# EAGLE design pwm_driver (EAGLE 7.5.0)
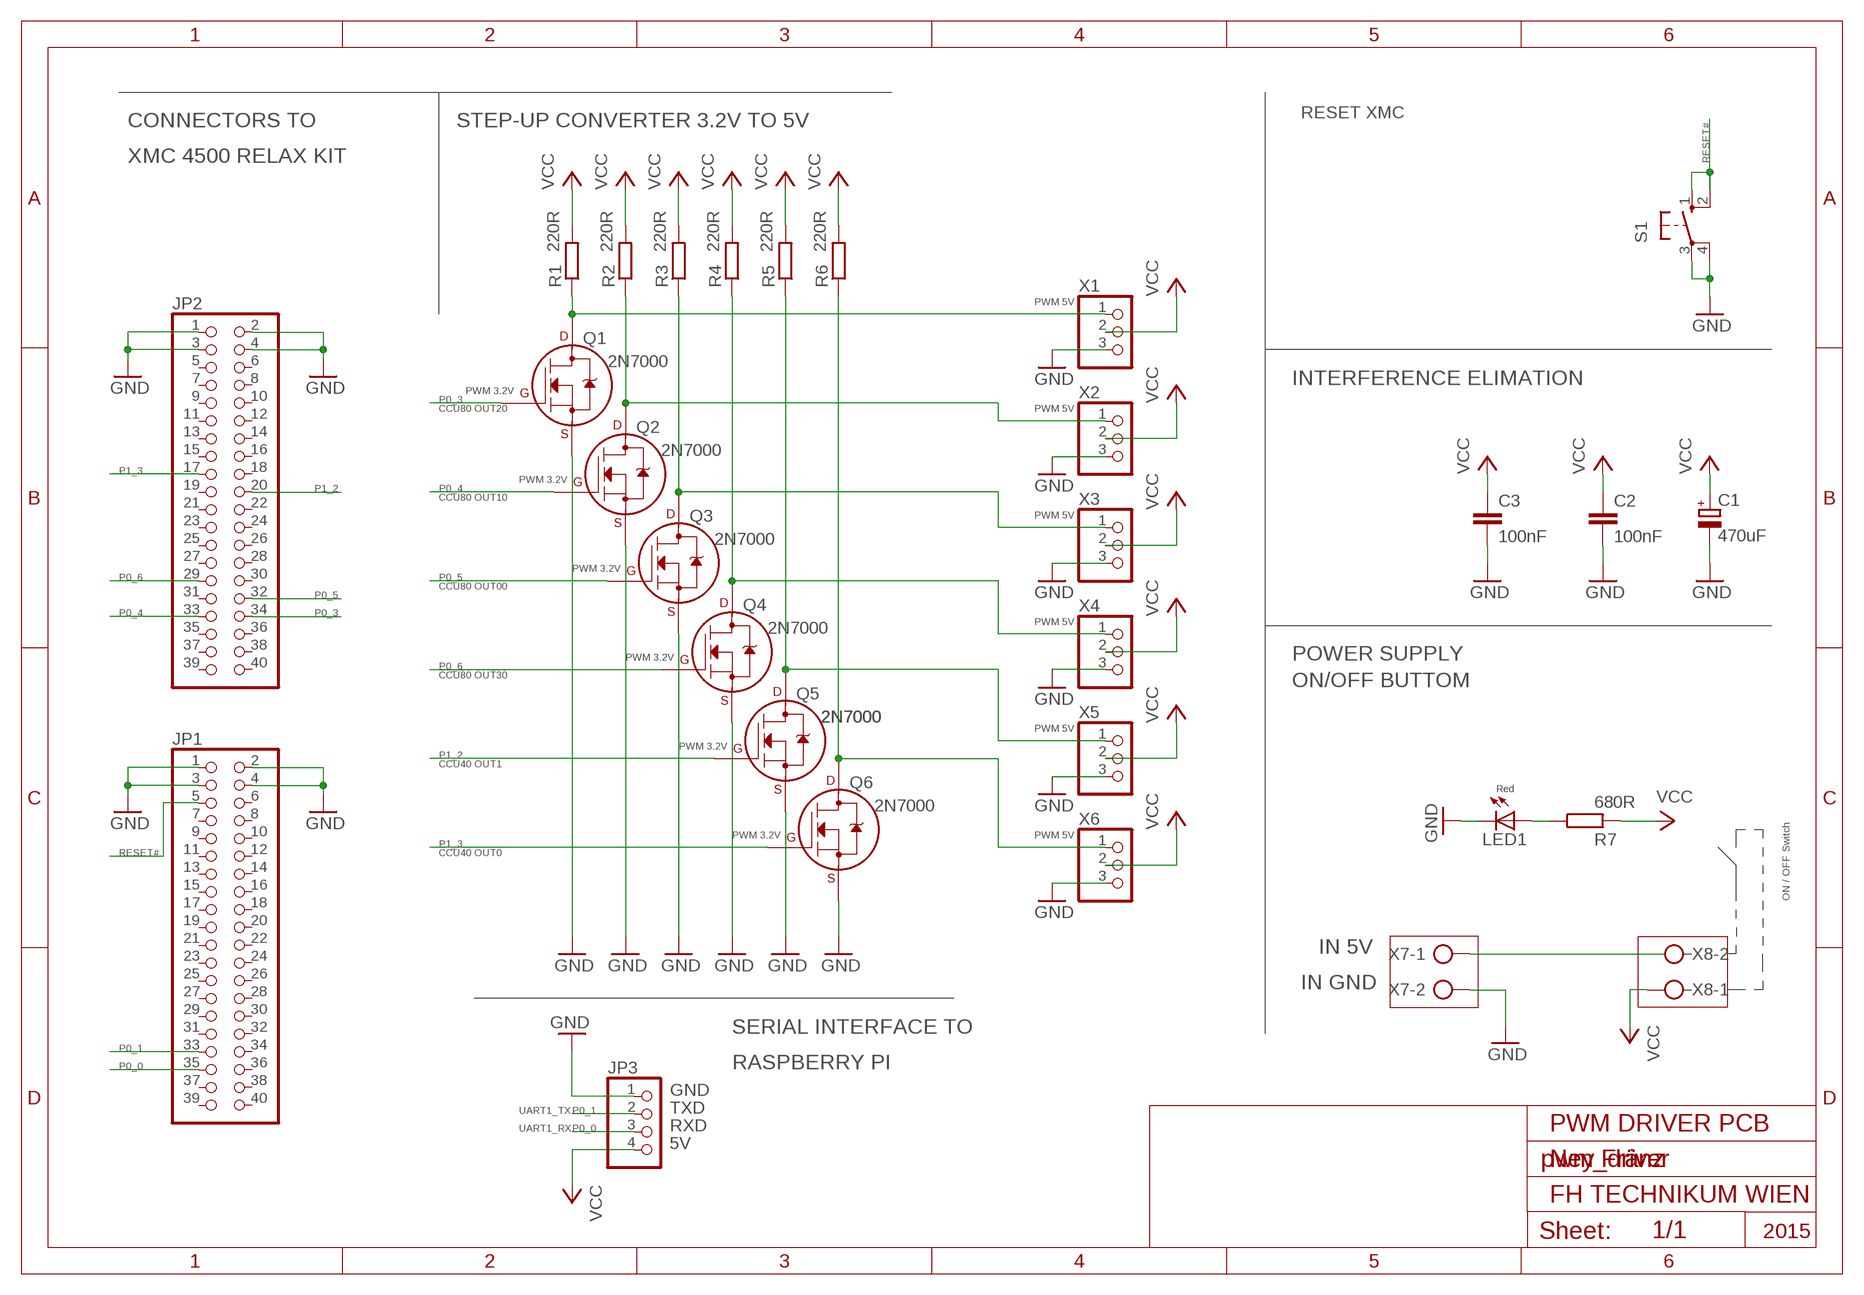
[diagram p0: schematic, sheet 1]

## Parts
C1  470uF  CPOL-EUE3.5-10  [E3,5-10]
C2  100nF  C-EU025-024X044  [C025-024X044]
C3  100nF  C-EU025-024X044  [C025-024X044]
JP1  PINHD-2X20  [2X20]
JP2  PINHD-2X20  [2X20]
JP3  PINHD-1X4  [1X04]
LED1  LED3MM  [LED3MM]
Q1  2N7000_TO92  [TO-92]
Q2  2N7000_TO92  [TO-92]
Q3  2N7000_TO92  [TO-92]
Q4  2N7000_TO92  [TO-92]
Q5  2N7000_TO92  [TO-92]
Q6  2N7000_TO92  [TO-92]
R1  220R  R-EU_0207/10  [0207/10]
R2  220R  R-EU_0207/10  [0207/10]
R3  220R  R-EU_0207/10  [0207/10]
R4  220R  R-EU_0207/10  [0207/10]
R5  220R  R-EU_0207/10  [0207/10]
R6  220R  R-EU_0207/10  [0207/10]
R7  680R  R-EU_0207/10  [0207/10]
S1  10-XX  [B3F-10XX]
X1  PINHD-1X3  [1X03]
X2  PINHD-1X3  [1X03]
X3  PINHD-1X3  [1X03]
X4  PINHD-1X3  [1X03]
X5  PINHD-1X3  [1X03]
X6  PINHD-1X3  [1X03]
X7  AK500/2  [AK500/2]
X8  AK500/2  [AK500/2]

## Nets
GND: C1.- C2.2 C3.2 JP1.1 JP1.2 JP1.3 JP1.4 JP2.1 JP2.2 JP2.3 JP2.4 JP3.1 LED1.K(C) Q1.1(S) Q2.1(S) Q3.1(S) Q4.1(S) Q5.1(S) Q6.1(S) S1.3(P) S1.4(P1) X1.3 X2.3 X3.3 X4.3 X5.3 X6.3 X7.2
N$1: LED1.A R7.1
N$2: X7.1 X8.2
N$4: Q1.3(D) R1.1 X1.1
N$5: Q2.3(D) R2.1 X2.1
N$6: Q3.3(D) R3.1 X3.1
N$7: Q4.3(D) R4.1 X4.1
N$11: Q5.3(D) R5.1 X5.1
N$17: Q6.3(D) R6.1 X6.1
P0_0: JP1.35 JP3.3
P0_1: JP1.33 JP3.2
P0_3: JP2.34 Q1.2(G)
P0_4: JP2.33 Q2.2(G)
P0_5: JP2.32 Q3.2(G)
P0_6: JP2.29 Q4.2(G)
P1_2: JP2.20 Q5.2(G)
P1_3: JP2.17 Q6.2(G)
RESET: JP1.5 S1.1(S) S1.2(S1)
VCC: C1.+ C2.1 C3.1 JP3.4 R1.2 R2.2 R3.2 R4.2 R5.2 R6.2 R7.2 X1.2 X2.2 X3.2 X4.2 X5.2 X6.2 X8.1
Unconnected: JP1.6 JP1.7 JP1.8 JP1.9 JP1.10 JP1.11 JP1.12 JP1.13 JP1.14 JP1.15 JP1.16 JP1.17 JP1.18 JP1.19 JP1.20 JP1.21 JP1.22 JP1.23 JP1.24 JP1.25 JP1.26 JP1.27 JP1.28 JP1.29 JP1.30 JP1.31 JP1.32 JP1.34 JP1.36 JP1.37 JP1.38 JP1.39 JP1.40 JP2.5 JP2.6 JP2.7 JP2.8 JP2.9 JP2.10 JP2.11 JP2.12 JP2.13 JP2.14 JP2.15 JP2.16 JP2.18 JP2.19 JP2.21 JP2.22 JP2.23 JP2.24 JP2.25 JP2.26 JP2.27 JP2.28 JP2.30 JP2.31 JP2.35 JP2.36 JP2.37 JP2.38 JP2.39 JP2.40

## Notes on the sheet
- RESET XMC
- CONNECTORS TO | STEP-UP CONVERTER 3.2V TO 5V
- XMC 4500 RELAX KIT | RESET#
- PWM 5V
- 2N7000
- INTERFERENCE ELIMATION
- PWM 3.2V
- P0_3
- CCU80 OUT20 | PWM 5V
- 2N7000
- P1_3
- PWM 3.2V
- P1_2 | P0_4
- CCU80 OUT10
- PWM 5V
- 2N7000
- PWM 3.2V
- P0_6 | P0_5
- CCU80 OUT00
- P0_5
- P0_4 | P0_3
- PWM 5V
- 2N7000
- PWM 3.2V | POWER SUPPLY
- P0_6
- CCU80 OUT30
- ON/OFF BUTTOM
- 2N7000 | 2N7000
- PWM 5V
- PWM 3.2V
- P1_2
- CCU40 OUT1
- Red
- 2N7000
- PWM 3.2V | PWM 5V
- P1_3
- RESET# | CCU40 OUT0
- ON / OFF Switch
- IN 5V
- IN GND
- SERIAL INTERFACE TO
- P0_1
- P0_0 | RASPBERRY PI
- GND
- UART1_TX | P0_1 | TXD
- UART1_RX | P0_0 | RXD | PWM DRIVER PCB
- 5V
- Ney Fränz
- FH TECHNIKUM WIEN
- 2015

## Library data of the parts
C1 = rcl:CPOL-EU: POLARIZED CAPACITOR, European symbol
C2 C3 = rcl:C-EU: CAPACITOR, European symbol
JP1 JP2 = pinhead:PINHD-2X20: PIN HEADER
JP3 = pinhead:PINHD-1X4: PIN HEADER
LED1 = led:LED: LED OSRAM: - CHIPLED LG R971, LG N971, LY N971, LG Q971, LY Q971, LO R971, LY R971 LH N974, LH R974 LS Q976, LO Q976, LY Q976 LO Q996 - Hyper CHIPLED LW Q18S LB Q993, LB Q99A, LB R99A - SideLED LS A670, LO A670, LY A670, LG A670, LP A670 LB A673, LV A673, LT A673, LW A673 LH A674 LY A675 LS A676, LA A676, LO A676, LY A676, LW A676 LS A679, LY A679, LG A679 - Hyper Micro SIDELED® LS Y876, LA Y876, LO Y876, LY Y876 LT Y87S - SmartLED LW L88C, LW L88S LB L89C, LB L89S, LG L890 LS L89K, LO L89K, LY L89K LS L896, LA L896, LO L896, LY L896 - TOPLED LS T670, LO T670, LY T670, LG T670, LP T670 LSG T670, LSP T670, LSY T670, LOP T670, LYG T670 LG T671, LOG T671, LSG T671 LB T673, LV T673, LT T673, LW T673 LH T674 LS T676, LA T676, LO T676, LY T676, LB T676, LH T676, LSB T676, LW T676 LB T67C, LV T67C, LT T67C, LS T67K, LO T67K, LY T67K, LW E67C LS E67B, LA E67B, LO E67B, LY E67B, LB E67C, LV E67C, LT E67C LW T67C LS T679, LY T679, LG T679 LS T770, LO T770, LY T770, LG T770, LP T770 LB T773, LV T773, LT T773, LW T773 LH T774 LS E675, LA E675, LY E675, LS T675 LS T776, LA T776, LO T776, LY T776, LB T776 LHGB T686 LT T68C, LB T68C - Hyper Mini TOPLED® LB M676 - Mini TOPLED Santana® LG M470 LS M47K, LO M47K, LY M47K Source: http://www.osram.convergy.de LUXEON: - LUMILED® LXK2-PW12-R00, LXK2-PW12-S00, LXK2-PW14-U00, LXK2-PW14-V00 LXK2-PM12-R00, LXK2-PM12-S00, LXK2-PM14-U00 LXK2-PE12-Q00, LXK2-PE12-R00, LXK2-PE12-S00, LXK2-PE14-T00, LXK2-PE14-U00 LXK2-PB12-K00, LXK2-PB12-L00, LXK2-PB12-M00, LXK2-PB14-N00, LXK2-PB14-P00, LXK2-PB14-Q00 LXK2-PR12-L00, LXK2-PR12-M00, LXK2-PR14-Q00, LXK2-PR14-R00 LXK2-PD12-Q00, LXK2-PD12-R00, LXK2-PD12-S00 LXK2-PH12-R00, LXK2-PH12-S00 LXK2-PL12-P00, LXK2-PL12-Q00, LXK2-PL12-R00 Source: www.luxeon.com KINGBRIGHT: KA-3528ASYC Source: www.kingbright.com
Q1-Q6 = transistors:2N700*: 2N7000, 2N7002, NDS7002A N-channel enhancement mode MOSFET
R1-R7 = resistor:R-EU_: RESISTOR, European symbol
S1 = switch-omron:10-XX: OMRON SWITCH; MPN: B3F-1000; OC_FARNELL: 176432; OC_NEWARK: 36M3542
X1-X6 = pinhead:PINHD-1X3: PIN HEADER
X7 X8 = con-ptr500:AK500/2: CONNECTOR; OC_FARNELL: unknown; OC_NEWARK: unknown

## Board
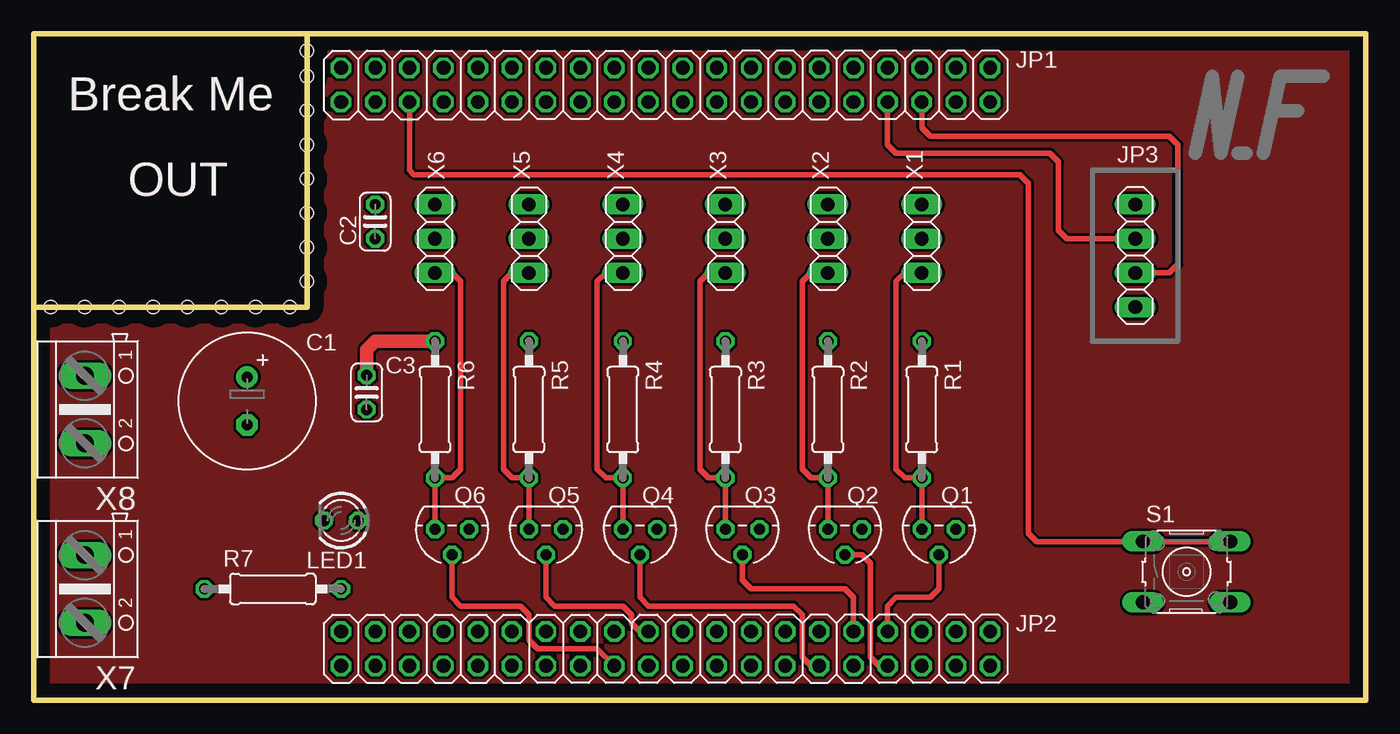
[diagram p1: board, top side]
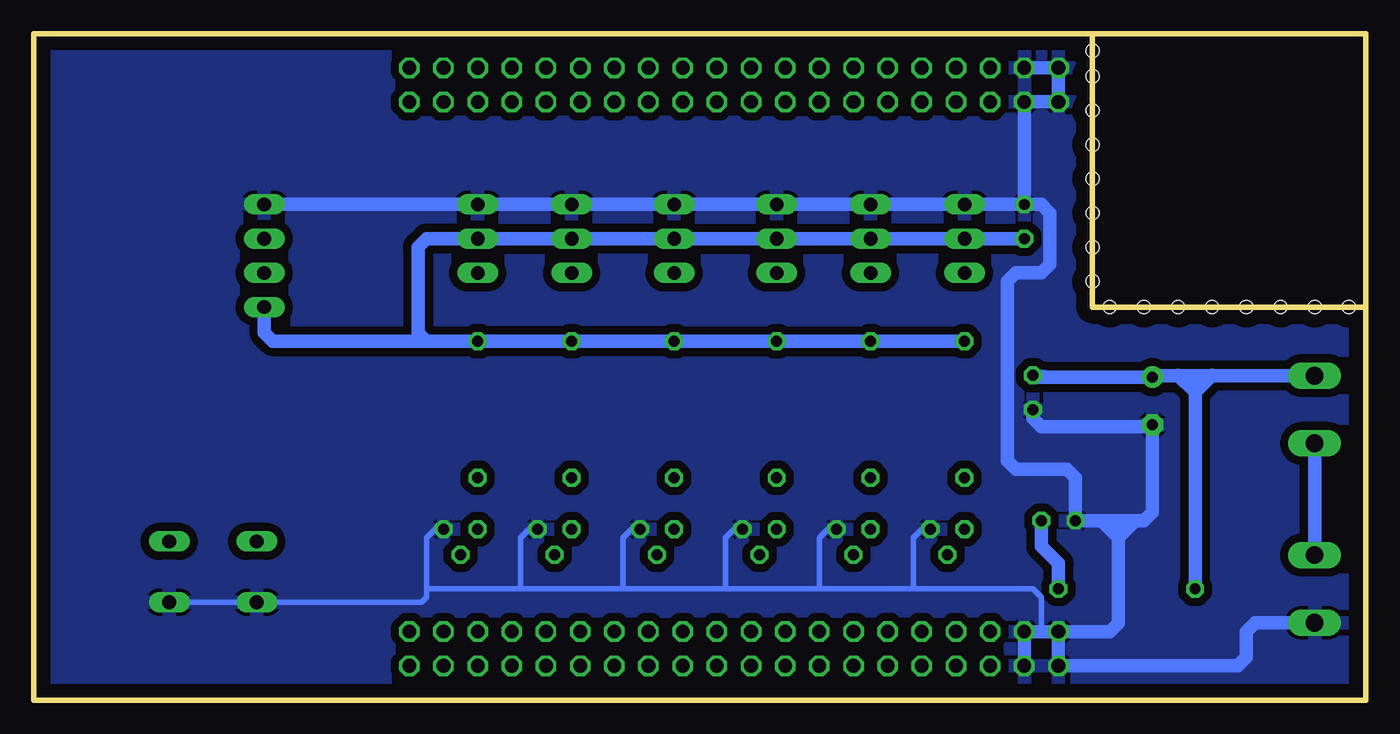
[diagram p2: board, bottom side, seen from below]

Size 99.06 x 49.53 mm. Coordinates in mm from the lower left corner, seen from the top.
Outline: 0,29.21 0,0 99.06,0 99.06,49.53 20.32,49.53
Outline: 0,29.21 0,49.53 20.32,49.53
Outline: 20.32,49.53 20.32,29.21 0,29.21
Copper layers (1*16): Top 0.035mm / dielectric 1.5mm / Bottom 0.035mm
Design rules "default": minimum track width 10mil, minimum drill 24mil, track to track 8mil, track to pad 8mil, pad to pad 8mil, via to via 8mil, smd to smd 8mil, copper to edge 40mil, drill to drill 8mil, minimum pad ring 10mil, minimum via ring 8mil, stop-mask expansion 4mil, vias tented up to drill 0mil, thermal gap 10mil
Holes 1 mm at 1.27,29.21 3.81,29.21 6.35,29.21 8.89,29.21 11.43,29.21 13.97,29.21 16.51,29.21 19.05,29.21 20.32,31.11 20.32,33.66 20.32,36.2 20.32,38.73 20.32,41.27 20.32,43.81 20.32,46.35 20.32,48.26

### Footprints (pad centres in the part's own frame; a part is rotated, then mirrored left to right if it is on the bottom)
E3,5-10 = drill 0.813 pad 1.6: + -1.778,0 | drill 0.813 pad 1.6 octagon: - 1.778,0
C025-024X044 = drill 0.813 octagon: 1 -1.27,0; 2 1.27,0
2X20 = drill 1.016 octagon: 1 -24.13,-1.27; 2 -24.13,1.27; 3 -21.59,-1.27; 4 -21.59,1.27; 5 -19.05,-1.27; 6 -19.05,1.27; 7 -16.51,-1.27; 8 -16.51,1.27; 9 -13.97,-1.27; 10 -13.97,1.27; 11 -11.43,-1.27; 12 -11.43,1.27; 13 -8.89,-1.27; 14 -8.89,1.27; 15 -6.35,-1.27; 16 -6.35,1.27; 17 -3.81,-1.27; 18 -3.81,1.27; 19 -1.27,-1.27; 20 -1.27,1.27; 21 1.27,-1.27; 22 1.27,1.27; 23 3.81,-1.27; 24 3.81,1.27; 25 6.35,-1.27; 26 6.35,1.27; 27 8.89,-1.27; 28 8.89,1.27; 29 11.43,-1.27; 30 11.43,1.27; 31 13.97,-1.27; 32 13.97,1.27; 33 16.51,-1.27; 34 16.51,1.27; 35 19.05,-1.27; 36 19.05,1.27; 37 21.59,-1.27; 38 21.59,1.27; 39 24.13,-1.27; 40 24.13,1.27
1X04 = drill 1.016 long: 1 -3.81,0; 2 -1.27,0; 3 1.27,0; 4 3.81,0
LED3MM = drill 0.813 octagon: A -1.27,0; K 1.27,0
TO-92 = drill 0.813 octagon: 1 -1.27,0; 2 0,1.905; 3 1.27,0
0207/10 = drill 0.813 octagon: 1 -5.08,0; 2 5.08,0
B3F-10XX = drill 1.016 long: 1 -3.251,2.261; 2 3.251,2.261; 3 -3.251,-2.261; 4 3.251,-2.261
1X03 = drill 1.016 long: 1 -2.54,0; 2 0,0; 3 2.54,0
AK500/2 = drill 1.321 long: 1 -2.515,0; 2 2.515,0

### Placement (x,y rotation side)
C1  15.88,22.23 270 top
C2  25.4,35.56 90 top
C3  24.77,22.86 270 top
JP1  46.99,45.72 0 top
JP2  46.99,3.81 0 top
JP3  81.92,33.02 270 top
LED1  22.86,13.34 180 top
Q1  67.31,12.7 180 top
Q2  60.33,12.7 180 top
Q3  52.7,12.7 180 top
Q4  45.09,12.7 180 top
Q5  38.1,12.7 180 top
Q6  31.11,12.7 180 top
R1  66.04,21.59 90 top
R2  59.05,21.59 90 top
R3  51.44,21.59 90 top
R4  43.81,21.59 90 top
R5  36.83,21.59 90 top
R6  29.84,21.59 90 top
R7  17.78,8.26 180 top
S1  85.72,9.53 0 top
X1  66.04,34.29 90 top
X2  59.05,34.29 90 top
X3  51.44,34.29 90 top
X4  43.81,34.29 90 top
X5  36.83,34.29 90 top
X6  29.84,34.29 90 top
X7  3.81,8.26 270 top
X8  3.81,21.59 270 top

### Tracks (layer width: path | path; a pad name or v marks a point on that pad's centre or on a via)
GND
  Bottom 0.406: Q6.1 33.02,12.7 33.66,12.06 33.66,8.26 | 33.66,8.26 24.77,8.26 24.13,7.62 24.13,5.08 | Q5.1 40.01,12.7 40.64,12.06 40.64,8.26 | 40.64,8.26 33.66,8.26 | Q4.1 46.99,12.7 47.62,12.06 47.62,8.26 | 47.62,8.26 40.64,8.26 | Q3.1 54.61,12.7 55.24,12.06 55.24,8.26 | 55.24,8.26 47.62,8.26 | Q2.1 62.23,12.7 62.87,12.06 62.87,8.26 | 62.87,8.26 55.24,8.26 | Q1.1 69.22,12.7 69.85,12.06 69.85,8.26 | 69.85,8.26 62.87,8.26 | S1.3 S1.4 70.21,7.26 69.85,7.62 69.85,8.26
  Bottom 1.016: JP2.2 24.13,5.08 JP2.4 JP2.3 | JP2.2 JP2.1 9.53,2.54 8.89,3.17 8.89,5.08 8.23,5.74 X7.2 | JP1.4 JP1.2 JP1.1 JP1.3 C2.2 | JP3.1 X1.3 X2.3 X3.3 X4.3 X5.3 X6.3 C2.2 | C2.2 24.13,36.83 23.5,36.2 23.5,32.38 24.13,31.75 26.04,31.75 26.67,31.11 26.67,17.78 26.04,17.14 22.23,17.14 21.59,16.51 LED1.K 19.68,13.34 | 18.41,13.34 17.14,13.34 | 17.14,13.34 16.51,13.34 15.88,13.97 C1.- 16,20.32 24.13,20.32 24.77,20.95 C3.2 | 19.68,13.34 18.41,13.34 | 18.41,13.34 18.41,12.06 | 18.41,12.06 18.41,5.71 19.05,5.08 JP2.2 | 18.41,12.06 17.14,13.34 | 18.41,12.06 19.68,13.34
  pour Bottom (isolate 0.61): 0,49.53 99.06,49.53 99.06,0 0,0
N$1
  Bottom 1.016: R7.1 22.86,10.16 24.13,11.43 LED1.A
N$2
  Bottom 1.016: X7.1 X8.2
N$3
  pour Top: 0,0 0,28.57 20.32,28.57 20.32,29.21 20.32,48.9 20.32,49.53 99.06,49.53 99.06,0
N$4
  Top 0.406: Q1.3 R1.1 64.77,16.51 64.14,17.14 64.14,31.11 64.77,31.75 X1.1
N$5
  Top 0.406: Q2.3 R2.1 57.78,16.51 57.15,17.14 57.15,31.11 57.78,31.75 X2.1
N$6
  Top 0.406: Q3.3 R3.1 50.16,16.51 49.53,17.14 49.53,31.11 50.16,31.75 X3.1
N$7
  Top 0.406: Q4.3 R4.1 42.55,16.51 41.91,17.14 41.91,31.11 42.55,31.75 X4.1
N$11
  Top 0.406: Q5.3 R5.1 35.56,16.51 34.92,17.14 34.92,31.11 35.56,31.75 X5.1
N$17
  Top 0.406: Q6.3 R6.1 31.11,16.51 31.75,17.14 31.75,31.11 31.11,31.75 X6.1
P0_0
  Top 0.406: JP3.3 84.45,31.75 85.09,32.38 85.09,41.27 84.45,41.91 66.67,41.91 66.04,42.55 JP1.35
P0_1
  Top 0.406: JP3.2 76.83,34.29 76.2,34.92 76.2,40.01 75.56,40.64 64.14,40.64 63.5,41.27 JP1.33
P0_3
  Top 0.406: Q1.2 67.31,8.26 66.67,7.62 64.14,7.62 63.5,6.99 JP2.34
P0_4
  Top 0.406: JP2.33 62.87,2.54 62.23,3.17 62.23,10.16 61.59,10.79 Q2.2
P0_5
  Top 0.406: JP2.32 60.96,7.62 60.33,8.26 53.34,8.26 52.7,8.89 Q3.2
P0_6
  Top 0.406: JP2.29 57.78,2.54 57.15,3.17 57.15,6.35 56.52,6.99 45.72,6.99 45.09,7.62 Q4.2
P1_2
  Top 0.406: JP2.20 45.09,5.08 44.45,5.71 44.45,6.35 43.81,6.99 38.73,6.99 38.1,7.62 Q5.2
P1_3
  Top 0.406: JP2.17 41.91,3.81 37.47,3.81 36.83,4.45 36.83,6.35 36.2,6.99 31.75,6.99 31.11,7.62 Q6.2
RESET
  Top 0.406: JP1.5 27.94,39.37 28.26,39.05 73.34,39.05 73.98,38.42 73.98,12.38 74.61,11.75 82.44,11.75 S1.1 82.51,11.75 88.9,11.75 88.94,11.79 S1.2
VCC
  Top 1.016: R6.2 25.4,26.67 24.77,26.04 C3.1
  Bottom 1.016: JP3.4 81.92,27.3 81.28,26.67 69.85,26.67 | 69.85,26.67 R1.2 R2.2 R3.2 R4.2 R5.2 R6.2 | 69.85,26.67 70.48,27.3 70.48,33.66 69.85,34.29 X1.2 X2.2 X3.2 X4.2 X5.2 X6.2 C2.1 | 23.5,24 C3.1 24.64,24 C1.+ 15.77,24.11 12.7,24.11 | X8.1 12.7,24.11 | R7.2 12.7,22.86 | 12.7,22.86 12.7,24.11 | 12.7,22.86 11.43,24.13 | 12.7,22.86 13.97,24.13

### Text on the board
tPlace: Break Me | OUT
tDocu: 1 | 2 | GND | GND | GND | GND | GND | GND | GND | 5V | 5V | 5V | 5V | 5V | 5V | TXD | RXD | PWM | PWM | PWM | PWM | PWM | PWM | 5V | NO | PWM DRIVER | FH TECHNIKUM WIEN | COM | NEY FRÄNZ | K | 5V | GND | 1 | 2 | RESET#